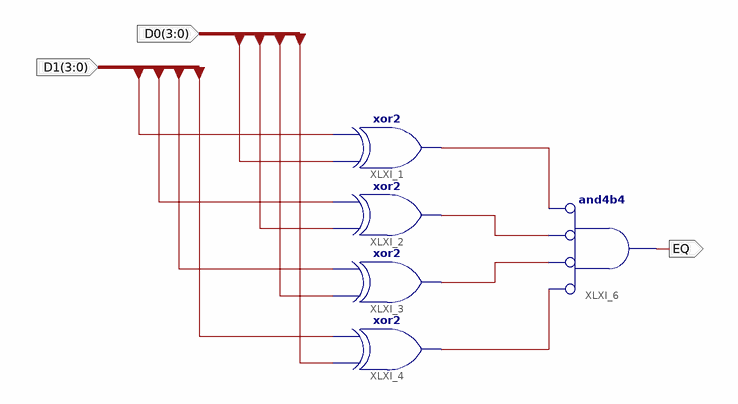
[diagram p0: schematic sheet 1]
// Xilinx ISE schematic compare4.sch (spartan6) as structural Verilog: 5 symbols, 3 ports
module compare4 (
  input  [3:0] D0,
  input  [3:0] D1,
  output EQ
);

  wire XLXN_11, XLXN_12, XLXN_13, XLXN_14;

  xor XLXI_1 (XLXN_11, D0[3], D1[3]);
  xor XLXI_2 (XLXN_12, D0[2], D1[2]);
  xor XLXI_3 (XLXN_13, D0[1], D1[1]);
  xor XLXI_4 (XLXN_14, D0[0], D1[0]);
  and XLXI_6 (EQ, ~XLXN_14, ~XLXN_13, ~XLXN_12, ~XLXN_11);  // and4b4
endmodule
